# Altium project SWITCH_BLE_V1I1.PrjPcb
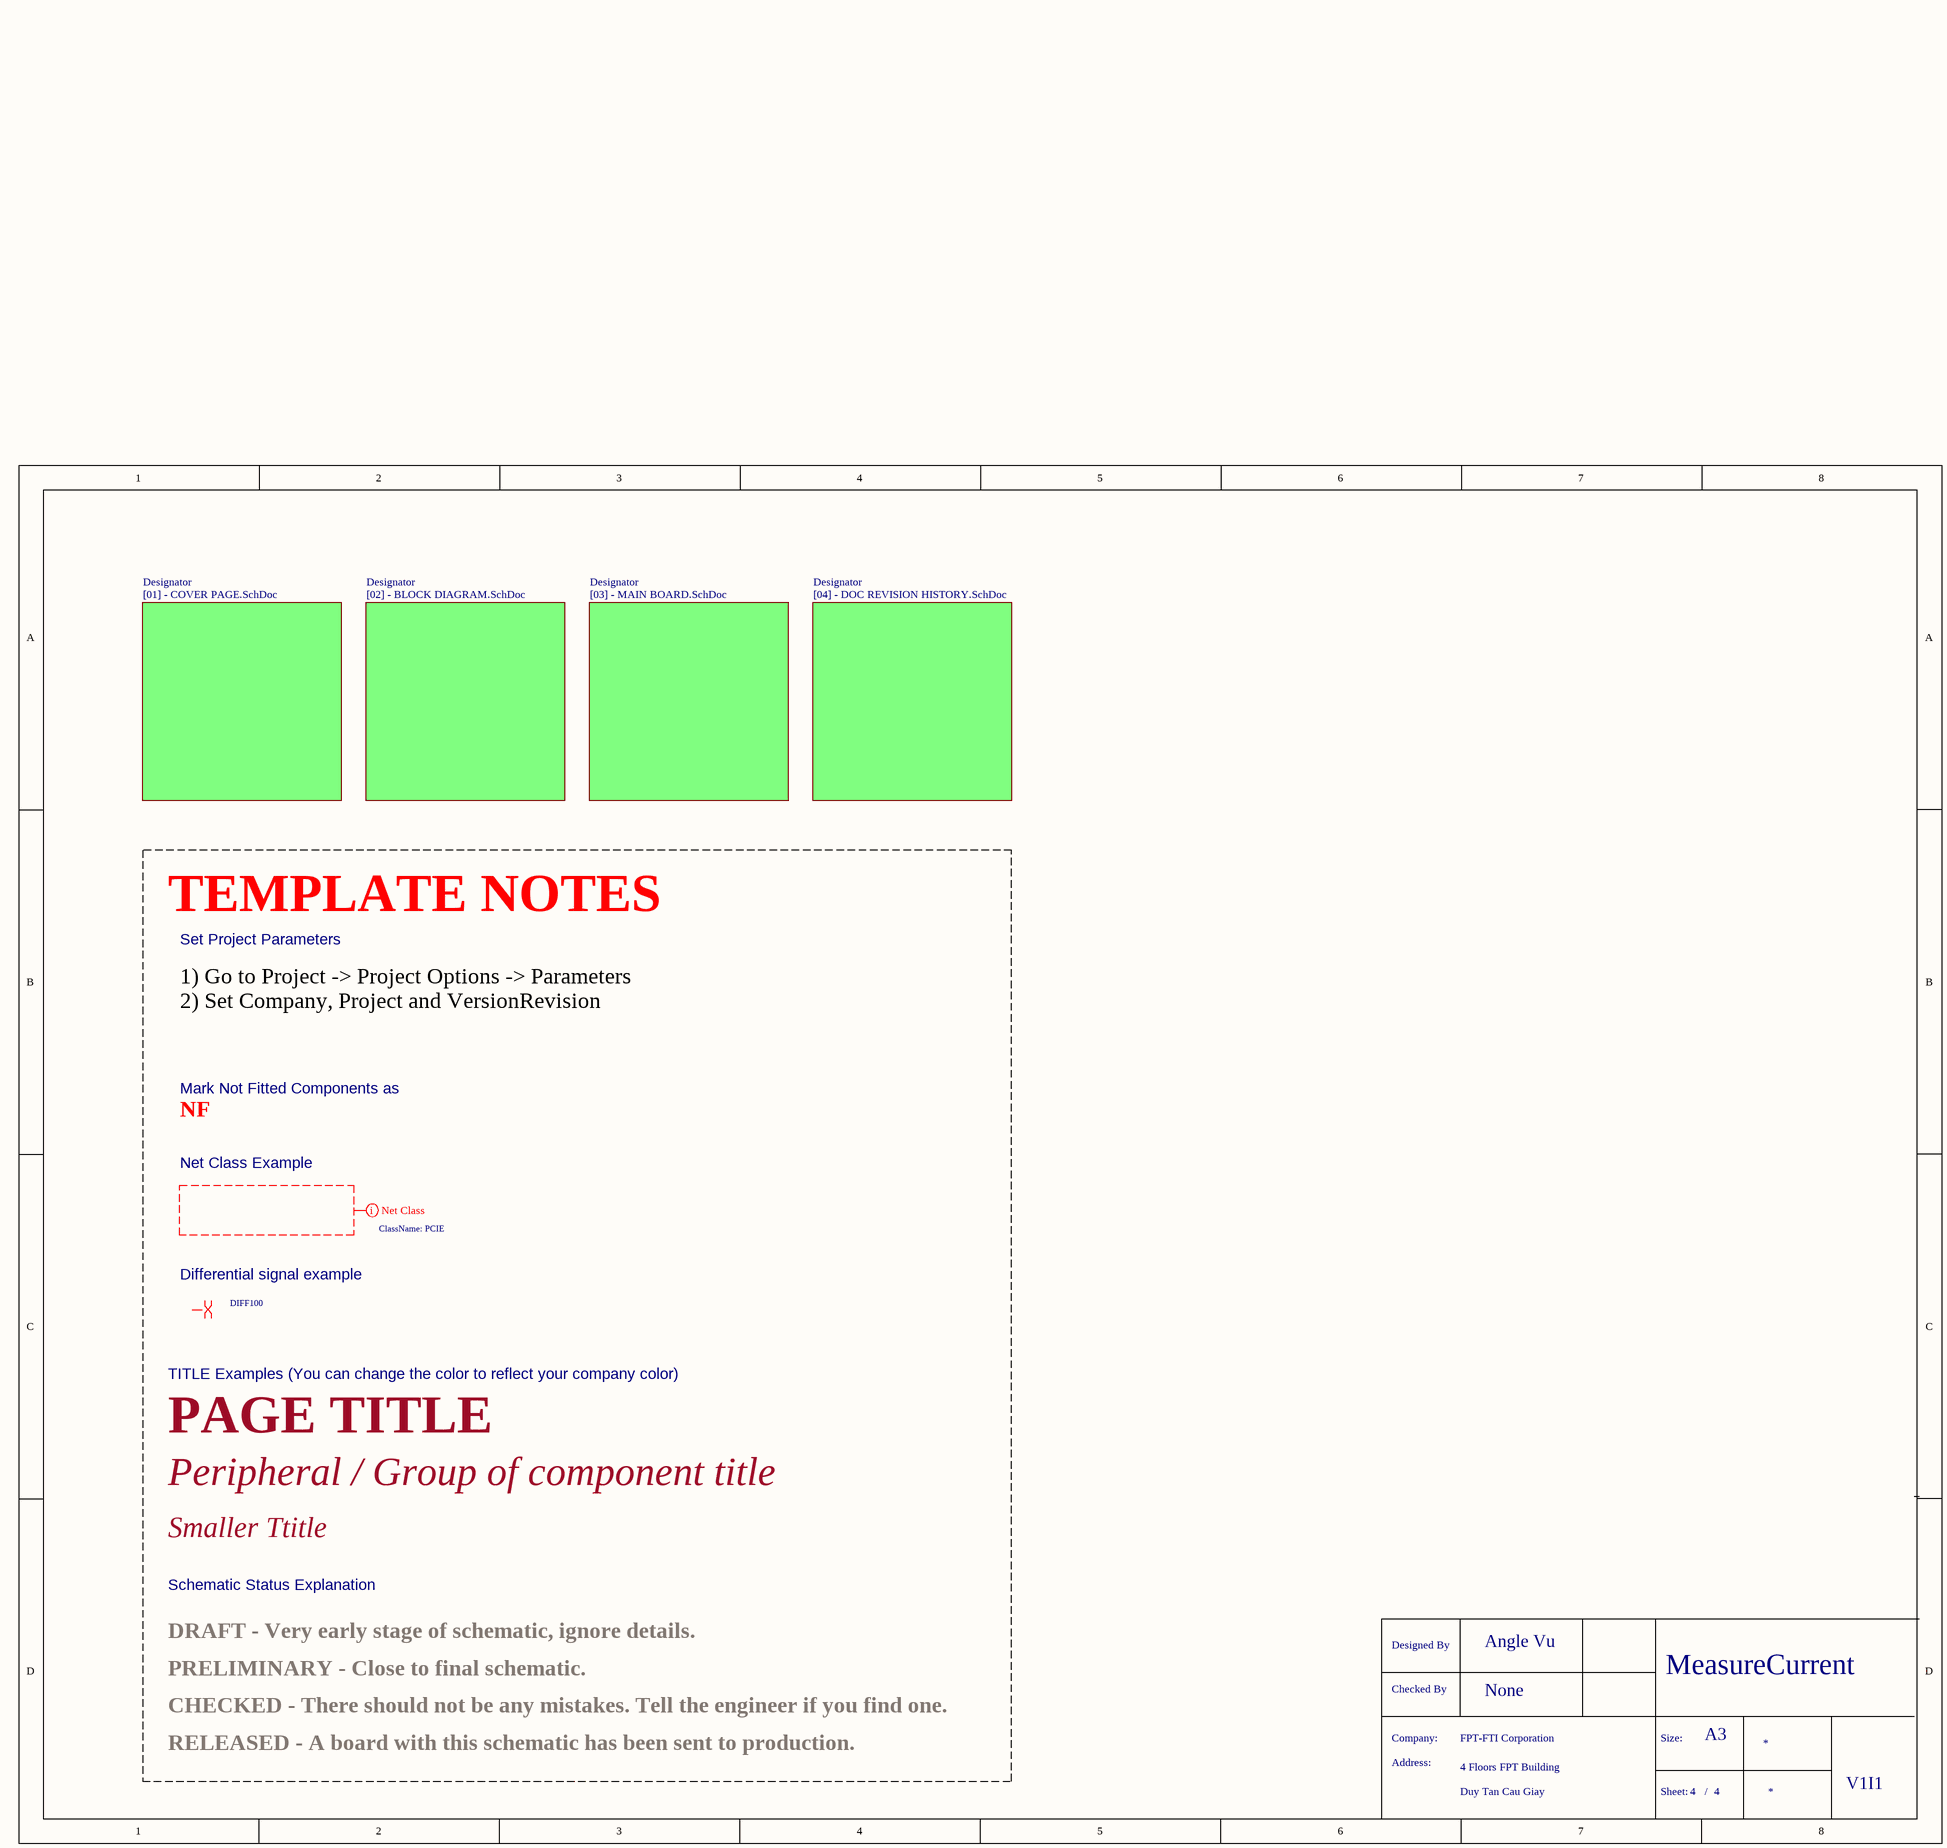
[diagram p0: SWITCH BLE V1I1 PROJECT.SchDoc]
addressName1: 4 Floors FPT Building; addressName2: Duy Tan Cau Giay; CNAME: FPT-FTI Corporation; NameAuthor: Angle Vu; NameChecker: None; NameProject: MeasureCurrent; Version: V1I1
5 sheets, 19 parts. Net scope: global (net labels, ports and power ports of the same name join across sheets).
Board file: SWITCH_BLE_PCB_V1I1.PcbDoc
Sheets:
  SWITCH BLE V1I1 PROJECT.SchDoc
    Designator = [01] - COVER PAGE.SchDoc
    Designator = [02] - BLOCK DIAGRAM.SchDoc
    Designator = [03] - MAIN BOARD.SchDoc
    Designator = [04] - DOC REVISION HISTORY.SchDoc

## Sheet SWITCH BLE V1I1 PROJECT.SchDoc
size A3; CompanyName: KDS; Organization: KDS; DocumentNumber: 4; Revision: V1I1; SheetNumber: 4; SheetTotal: 4; PageSetup: Record=PageOptions|CenterHorizontal=True|CenterVertical=True|PrintScale=1.07|XCorrection=1.00|YCorrection=1.00|PrintKind=1|BorderSize=5000000|LeftOffset=0|BottomOffset=0|Orientation=2|PaperLength=1000|PaperWidth=1000|Scale=100|PaperSource=7|PrintQuality=600|MediaType=1|DitherType=10|PaperKind=A3|PrintScaleMode=1; ProjectName: KDS C6A816x Module

### Sub-sheets
Designator = [01] - COVER PAGE.SchDoc: no entries
Designator = [02] - BLOCK DIAGRAM.SchDoc: no entries
Designator = [03] - MAIN BOARD.SchDoc: no entries
Designator = [04] - DOC REVISION HISTORY.SchDoc: no entries

### Layout directives
net class PCIE: (no net found under the mark)
differential pair; net class DIFF100: (no net found under the mark)

### Notes on the sheet
- TEMPLATE NOTES
- Set Project Parameters
- 1) Go to Project -> Project Options -> Parameters
  2) Set Company, Project and VersionRevision
- NF
- Mark Not Fitted Components as
- Net Class Example
- Differential signal example
- TITLE Examples (You can change the color to reflect your company color)
- PAGE TITLE
- Peripheral / Group of component title
- Smaller Ttitle
- Schematic Status Explanation
- PRELIMINARY - Close to final schematic.
- DRAFT - Very early stage of schematic, ignore details.
- CHECKED - There should not be any mistakes. Tell the engineer if you find one.
- RELEASED - A board with this schematic has been sent to production.
- Designed By
- Checked By
- Company:
- Size:
- A3
- Address:
- Sheet:
- /

## Sheet [01] - COVER PAGE.SchDoc
size A3; DocumentNumber: 1; SheetNumber: 1; SheetTotal: 4
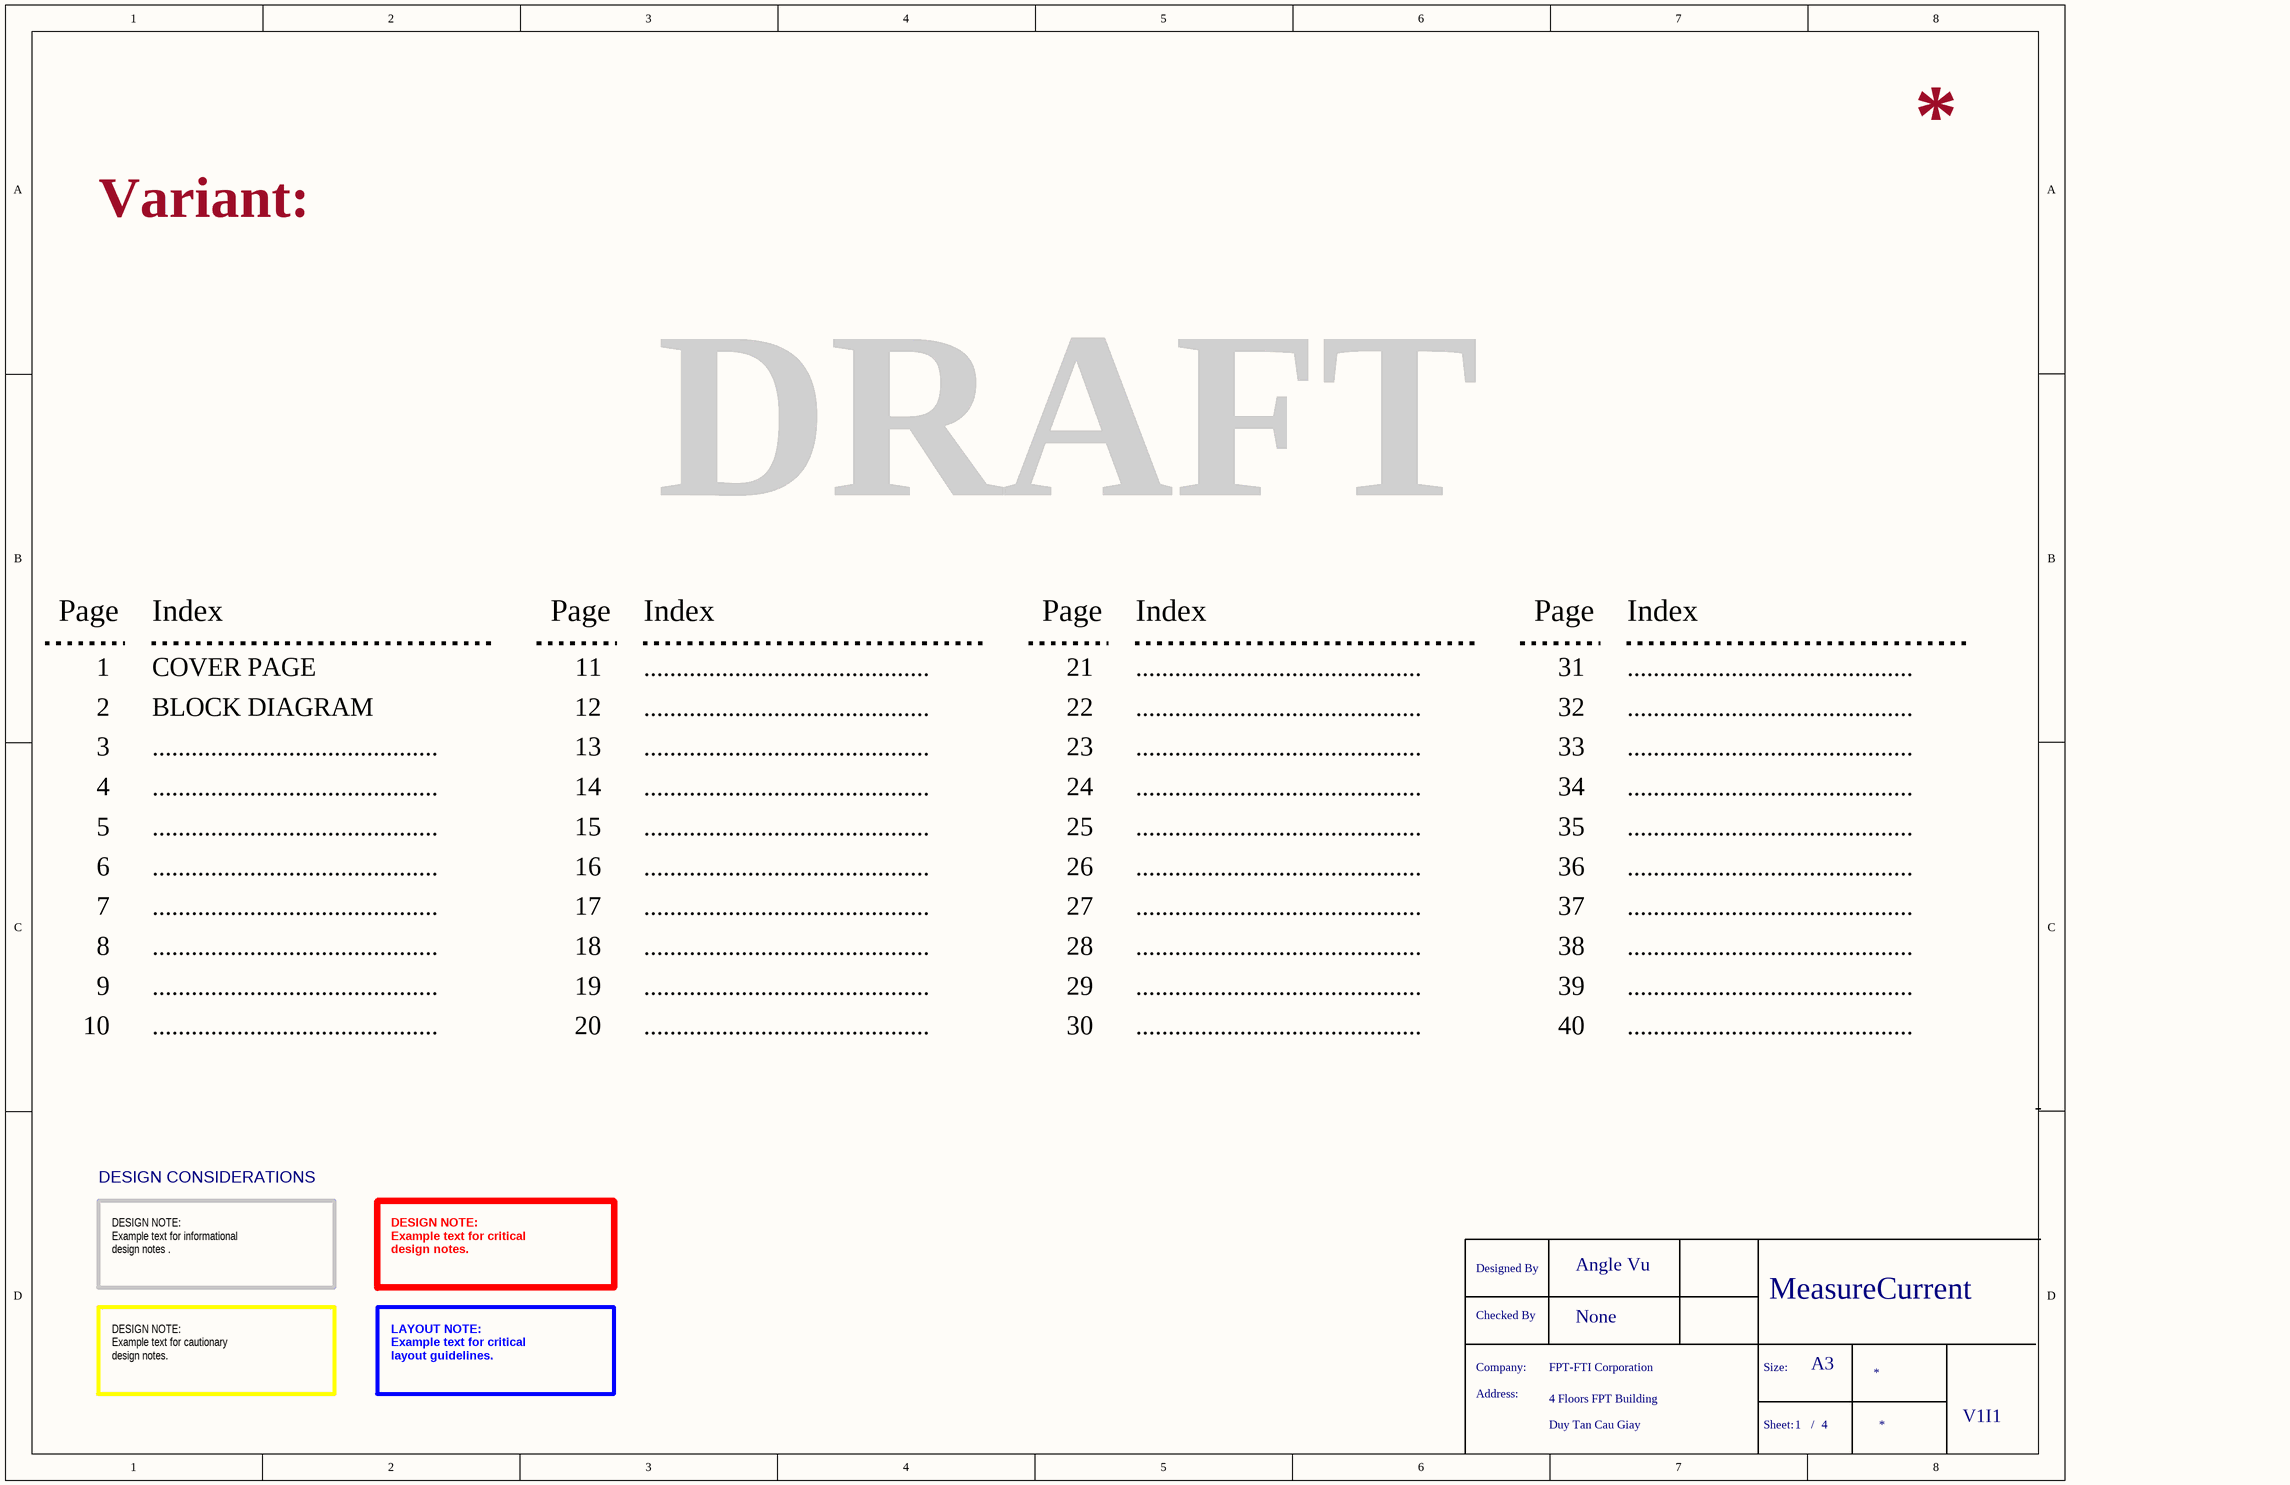
[diagram p1: [01] - COVER PAGE.SchDoc]

### Notes on the sheet
- Variant:
- DRAFT
- Page
- Index
- 1
- COVER PAGE
- 11
- ............................................
- 21
- 31
- 2
- 3
- BLOCK DIAGRAM
- 12
- 13
- 22
- 23
- 32
- 33
- 4
- 5
- 14
- 15
- 24
- 25
- 34
- 35
- 6
- 16
- 26
- 36
- 7
- 8
- 17
- 18
- 27
- 28
- 37
- 38
- 9
- 10
- 19
- 20
- 29
- 30
- 39
- 40
- DESIGN CONSIDERATIONS
- DESIGN NOTE:
  Example text for informational
  design notes .
- DESIGN NOTE:
  Example text for critical
  design notes.
- DESIGN NOTE:
  Example text for cautionary
  design notes.
- LAYOUT NOTE:
  Example text for critical
  layout guidelines.
- Designed By
- Checked By
- Company:
- Size:
- A3
- Address:
- Sheet:
- /

## Sheet [02] - BLOCK DIAGRAM.SchDoc
size A3; DocumentNumber: 2; SheetNumber: 2; SheetTotal: 4

### Notes on the sheet
- Designed By
- Checked By
- Company:
- Size:
- A3
- Address:
- Sheet:
- /

## Sheet [03] - MAIN BOARD.SchDoc
size A3; CompanyName: FPT-FTI copporation; Address1: FPT Building Duy Tan; Address2: Floor 4,; NameAuthor: Angle Vu
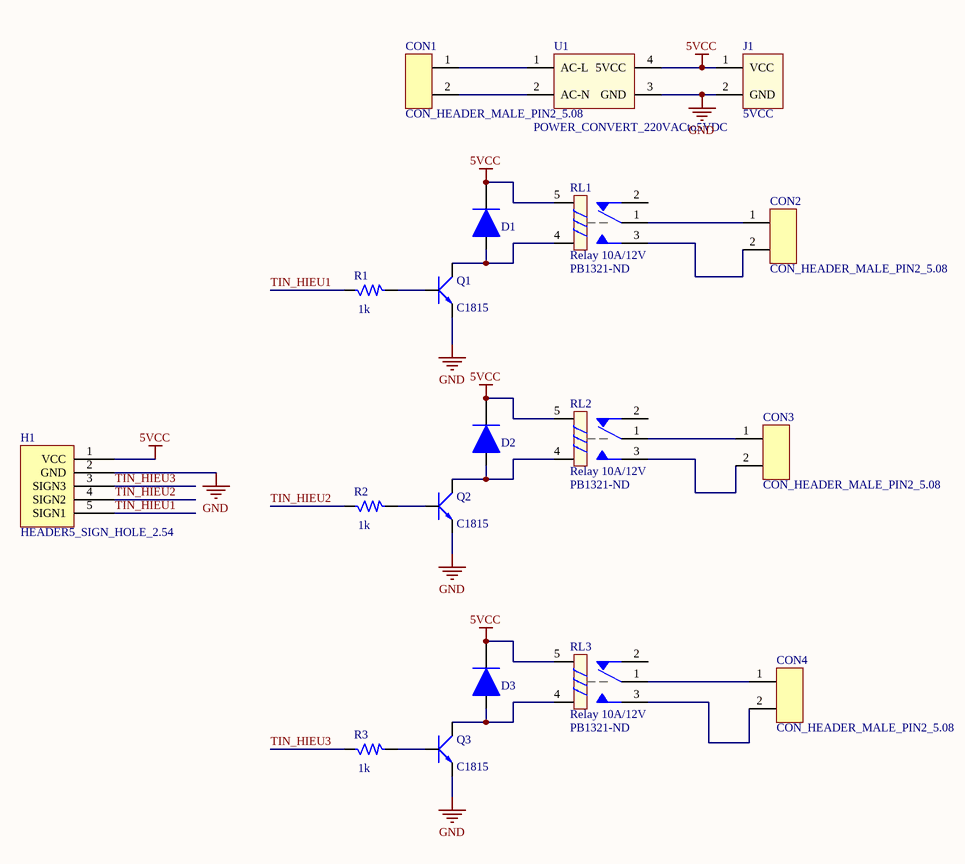
[diagram p2: [03] - MAIN BOARD.SchDoc]

### Parts
CON1  CON_HEADER_MALE_PIN2_5.08  [CON_HEADER_MALE_VAC]
CON2  CON_HEADER_MALE_PIN2_5.08  [CON_HEADER_MALE_PIN2]
CON3  CON_HEADER_MALE_PIN2_5.08  [CON_HEADER_MALE_PIN2]
CON4  CON_HEADER_MALE_PIN2_5.08  [CON_HEADER_MALE_PIN2]
D1  DIODE_M7_taobaoSMD_1A  [DIODE_SMD_M7]  (value not drawn)
D2  DIODE_M7_taobaoSMD_1A  [DIODE_SMD_M7]  (value not drawn)
D3  DIODE_M7_taobaoSMD_1A  [DIODE_SMD_M7]  (value not drawn)
H1  HEADER5_SIGN_HOLE_2.54  [HEADER5_SIGN_HOLE_2.54]
J1  5VCC  [CON_HEADER_MALE_POWER_PIN2_FRICTIONLOCK - duplicate]
Q1  value C1815  [TRAN-NPN-SMD]  (hidden comment: TRAN-NPN-SMD)
Q2  value C1815  [TRAN-NPN-SMD]  (hidden comment: TRAN-NPN-SMD)
Q3  value C1815  [TRAN-NPN-SMD]  (hidden comment: TRAN-NPN-SMD)
R1  Resistance (Ohms): 1k  [RES_SMD0603]  (hidden comment: R_1K_SMD0603_1%_1/10W)
R2  Resistance (Ohms): 1k  [RES_SMD0603]  (hidden comment: R_1K_SMD0603_1%_1/10W)
R3  Resistance (Ohms): 1k  [RES_SMD0603]  (hidden comment: R_1K_SMD0603_1%_1/10W)
RL1  Relay 10A/12V  Supplier Part Number 1: PB1321-ND  [RELAY_HOLE5PINS_10A]
RL2  Relay 10A/12V  Supplier Part Number 1: PB1321-ND  [RELAY_HOLE5PINS_10A]
RL3  Relay 10A/12V  Supplier Part Number 1: PB1321-ND  [RELAY_HOLE5PINS_10A]
U1  POWER_CONVERT_220VACto5VDC  [POWER_CONVERT220VACto5VDC]

### Nets
5VCC: D1.K D2.K D3.K H1.1(VCC) J1.1(VCC) RL1.5 RL2.5 RL3.5 U1.4(5VCC)
GND: H1.2(GND) J1.2(GND) Q1.2(E) Q2.2(E) Q3.2(E) U1.3(GND)
TIN_HIEU1: H1.5(SIGN1) R1.1
TIN_HIEU2: H1.4(SIGN2) R2.1
TIN_HIEU3: H1.3(SIGN3) R3.1
NetCON1_1: CON1.1(SIGN+) U1.1(AC-L)
NetCON1_2: CON1.2(SIGN-) U1.2(AC-N)
NetCON2_1: CON2.1(SIGN+) RL1.1
NetCON2_2: CON2.2(SIGN-) RL1.3
NetCON3_1: CON3.1(SIGN+) RL2.1
NetCON3_2: CON3.2(SIGN-) RL2.3
NetCON4_1: CON4.1(SIGN+) RL3.1
NetCON4_2: CON4.2(SIGN-) RL3.3
NetD1_A: D1.A Q1.3(C) RL1.4
NetD2_A: D2.A Q2.3(C) RL2.4
NetD3_A: D3.A Q3.3(C) RL3.4
NetQ1_1: Q1.1(B) R1.2
NetQ2_1: Q2.1(B) R2.2
NetQ3_1: Q3.1(B) R3.2

Not connected (* = marked no-connect by the designer): RL1 2; RL2 2; RL3 2

### Notes on the sheet
- Designed By
- Checked By
- Company:
- Size:
- A3
- Address:
- Sheet:
- /

### Library data of the parts
CON1-CON4 = CON_HEADER_MALE_PIN2_5.08: TERM BLOCK HDR 2POS R/A 5.08MM; Manufacturer: TE Connectivity AMP Connectors; Manufacturer Part Number: 282815-2; Number of Positions: 2; Number of Levels: 1; Pitch: 0.200" (5.08mm); Header Orientation: 90°, Right Angle; Current - UL: 15A; Voltage - UL: 300V; Supplier 1: Digi-Key; RoHS: RoHS Compliant; Category: Connectors, Interconnects; Stock 1: 1454; Pricing 1: 1=0.98, 10=0.609, 25=0.5212, 50=0.4686, 100=0.4588, 250=0.39052, 500=0.37098, 1000=0.33193, 2500=0.26359 (USD); Packaging: Bulk; Part Status: Active; Type: Header, Male Pins, Shrouded (2 Side); Positions Per Level: 2; Plug Wire Entry: -; Termination Style: Solder; Mounting Type: Through Hole; Current - IEC: -; Voltage - IEC: -; Wire Gauge or Range - AWG: -; Wire Gauge or Range - mm²: -; Color: Green; Operating Temperature: -40°C ~ 110°C; Contact Mating Finish: Tin; Features: Side Stacking; ComponentLink1URL: http://www.te.com/commerce/DocumentDelivery/DDEController?Action=srchrtrv&DocNm=282815&DocType=Customer+Drawing&DocLang=English; ComponentLink1Description: http://www.te.com/commerce/DocumentDelivery/DDEController?Action=srchrtrv&DocNm=282815&DocType=Customer+Drawing&DocLang=English; Supplier Part Number 1: A113298-ND
D1-D3 = DIODE_M7_taobaoSMD_1A: DIODE 1000V 1A SMD M7; Manufacturer: Diodes Incorporated; Manufacturer Part Number: 1N4148W-13-F; Diode Type: Standard; Voltage - Forward (Vf) (Max) @ If: 1.25V @ 150mA; Speed: Small Signal =< 200mA (Io), Any Speed; Reverse Recovery Time (trr): 4ns; Current - Reverse Leakage @ Vr: 1µA @ 75V; Capacitance @ Vr, F: 2pF @ 0V, 1MHz; Supplier 1: Taobao; RoHS: RoHS Compliant; Category: Discrete Semiconductor Products; Stock 1: 23168; Pricing 1: 1=0.18, 10=0.162, 100=0.0884, 500=0.05436, 1000=0.03708 (USD); Packaging: Cut Tape (CT); Part Status: Active; Voltage - DC Reverse (Vr) (Max): 1000V; Current - Average Rectified (Io): 1A; Mounting Type: Surface Mount; Package / Case: M7; Supplier Device Package: SMD M7; Operating Temperature - Junction: -65°C ~ 150°C; ComponentLink1URL: http://luguang.company.weiku.com/item/SMD-Diode-M7-4115666.html; ComponentLink1Description: http://luguang.company.weiku.com/item/SMD-Diode-M7-4115666.html; Supplier Part Number 1: 1N4148W-13FDICT-ND
H1 = HEADER5_SIGN_HOLE_2.54: CONN HEADER 5 POS 2.54; Manufacturer: Wurth Electronics Inc; Manufacturer Part Number: 61300511121; Connector Type: Header, Unshrouded; Number of Positions: 5; Number of Positions Loaded: All; Pitch: 0.100" (2.54mm); Supplier 1: Digi-Key; RoHS: RoHS Compliant; Category: Connectors, Interconnects; Stock 1: 5098; Pricing 1: 1=0.23, 100=0.2106, 500=0.1782 (USD); Packaging: Bulk; Part Status: Active; Contact Type: Male Pin; Number of Rows: 1; Row Spacing: -; Contact Mating Length: 0.236" (6.00mm); Mounting Type: Through Hole; Termination: Solder; Fastening Type: -; Features: -; Contact Finish: Gold; Contact Finish Thickness: -; Color: Black; ComponentLink1URL: http://katalog.we-online.de/em/datasheet/6130xx11121.pdf; ComponentLink1Description: http://katalog.we-online.de/em/datasheet/6130xx11121.pdf; Supplier Part Number 1: 732-5318-ND
J1 = CON_HEADER_POWER_MALE_PIN2_2.54_1: CONN HEADER VERT 2POS .100 TIN; Manufacturer: TE Connectivity AMP Connectors; Manufacturer Part Number: 640456-2; Connector Type: Header, Unshrouded; Number of Positions: 2; Number of Positions Loaded: All; Pitch: 0.100" (2.54mm); Supplier 1: Digi-Key; RoHS: RoHS Compliant; Category: Connectors, Interconnects; Stock 1: 121182; Pricing 1: 1=0.12, 10=0.083, 100=0.069, 500=0.066, 1000=0.058, 2000=0.052, 5000=0.05, 10000=0.041 (USD); Packaging: Bulk; Part Status: Active; Contact Type: Male Pin; Number of Rows: 1; Row Spacing: -; Contact Mating Length: 0.295" (7.49mm); Mounting Type: Through Hole; Termination: Solder; Fastening Type: Friction Lock; Features: -; Contact Finish: Tin; Contact Finish Thickness: -; Color: Natural; ComponentLink1URL: http://www.te.com/commerce/DocumentDelivery/DDEController?Action=srchrtrv&DocNm=640456&DocType=Customer+Drawing&DocLang=English; ComponentLink1Description: http://www.te.com/commerce/DocumentDelivery/DDEController?Action=srchrtrv&DocNm=640456&DocType=Customer+Drawing&DocLang=English; Supplier Part Number 1: A1921-ND
Q1-Q3 = TRAN-NPN-SMD: NPN 600mW, ECB
R1-R3 = R_1K_SMD0603_1%_1/10W: RES SMD 1K OHM 1% 1/10W 0603; Manufacturer: Yageo; Manufacturer Part Number: RC0603FR-071KL; Power (Watts): 0.1W, 1/10W; Temperature Coefficient: ±100ppm/°C; Supplier 1: Digi-Key; RoHS: RoHS Compliant; Category: Resistors; Stock 1: 6725000; Pricing 1: 5000=0.00167, 10000=0.00145, 25000=0.00128, 50000=0.00117, 125000=0.00115 (USD); Packaging: Tape & Reel (TR); Part Status: Active; Tolerance: ±1%; Composition: Thick Film; Features: Moisture Resistant; Operating Temperature: -55°C ~ 155°C; Package / Case: 0603 (1608 Metric); Supplier Device Package: 0603; Size / Dimension: 0.063" L x 0.031" W (1.60mm x 0.80mm); Height: 0.022" (0.55mm); Number of Terminations: 2; ComponentLink1URL: http://www.yageo.com/documents/recent/PYu-RC_Group_51_RoHS_L_04.pdf; ComponentLink1Description: http://www.yageo.com/documents/recent/PYu-RC_Group_51_RoHS_L_04.pdf; Supplier Part Number 1: 311-1.00KHRTR-ND
RL1-RL3 = RELAY_SPDT_HOLE5_10A_12VDC: Relay SPDT,10A - 12VDC 5 Pin; Manufacturer: TE Connectivity Potter & Brumfield Relays; Manufacturer Part Number: ORWH-SH-112D,N000; Value: Relay SPDT, 10A, 12V; Relay Type: General Purpose; Coil Type: Non Latching; Coil Current: 30mA; Contact Form: SPDT (1 Form C); Switching Voltage: 277VAC, 28VDC - Max; Turn On Voltage (Max): 8.4 VDC; Turn Off Voltage (Min): 1.2 VDC; Operate Time: 10ms; Release Time: 5ms; Coil Power: 360 mW; Coil Resistance: 400 Ohms; Supplier 1: Digi-Key; RoHS: RoHS Compliant; Category: Relays; Stock 1: 23029; Pricing 1: 1=0.91, 10=0.855, 25=0.76, 50=0.722, 100=0.684, 250=0.608, 500=0.57, 1000=0.532, 2500=0.5225 (USD); Packaging: Tube; Part Status: Active; Coil Voltage: 12VDC; Contact Rating (Current): 10A; Features: Insulation - Class A, Sealed - Fully; Mounting Type: Through Hole; Termination Style: PC Pin; Contact Material: Silver Cadmium Oxide (AgCdO); Operating Temperature: -30°C ~ 70°C; ComponentLink1URL: http://www.te.com/commerce/DocumentDelivery/DDEController?Action=srchrtrv&DocNm=1461069-5&DocType=Customer+Drawing&DocLang=En; ComponentLink1Description: http://www.te.com/commerce/DocumentDelivery/DDEController?Action=srchrtrv&DocNm=1461069-5&DocType=Customer+Drawing&DocLang=En

## Sheet [04] - DOC REVISION HISTORY.SchDoc
size A3; DocumentNumber: 3; SheetNumber: 3; SheetTotal: 4
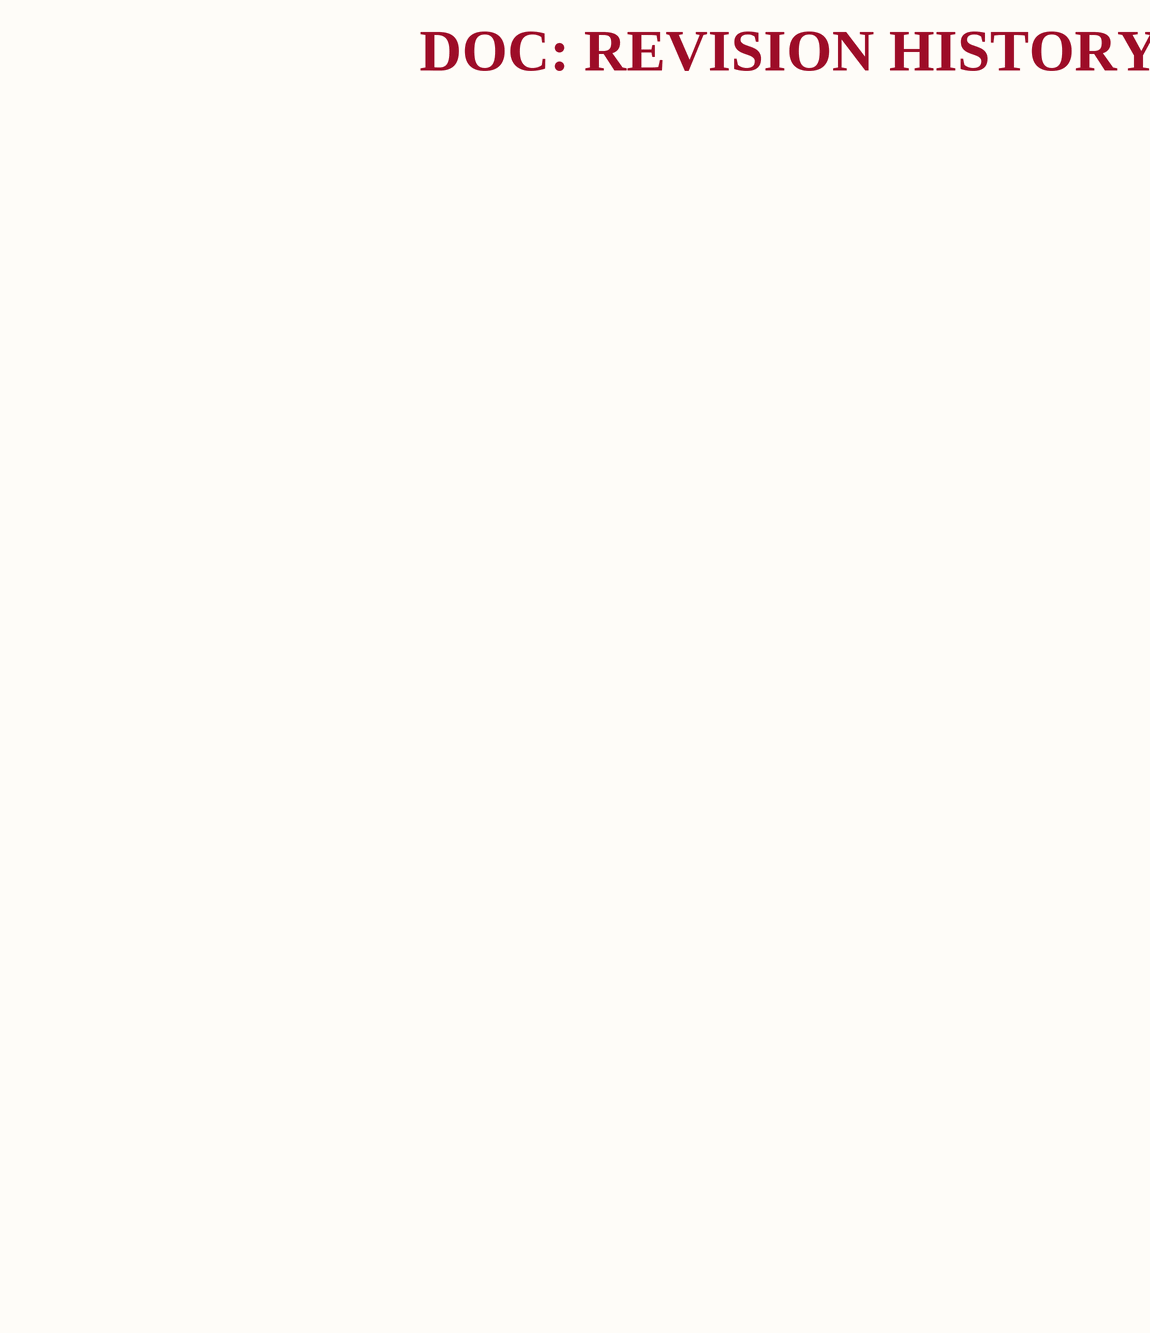
[diagram p3: [04] - DOC REVISION HISTORY.SchDoc]

### Notes on the sheet
- DOC: REVISION HISTORY
- CLOCKS (CPU & PCIE)
- Designed By
- Checked By
- Company:
- Size:
- A3
- Address:
- Sheet:
- /